# EAGLE schematic RasPiDV (EAGLE 6.3)
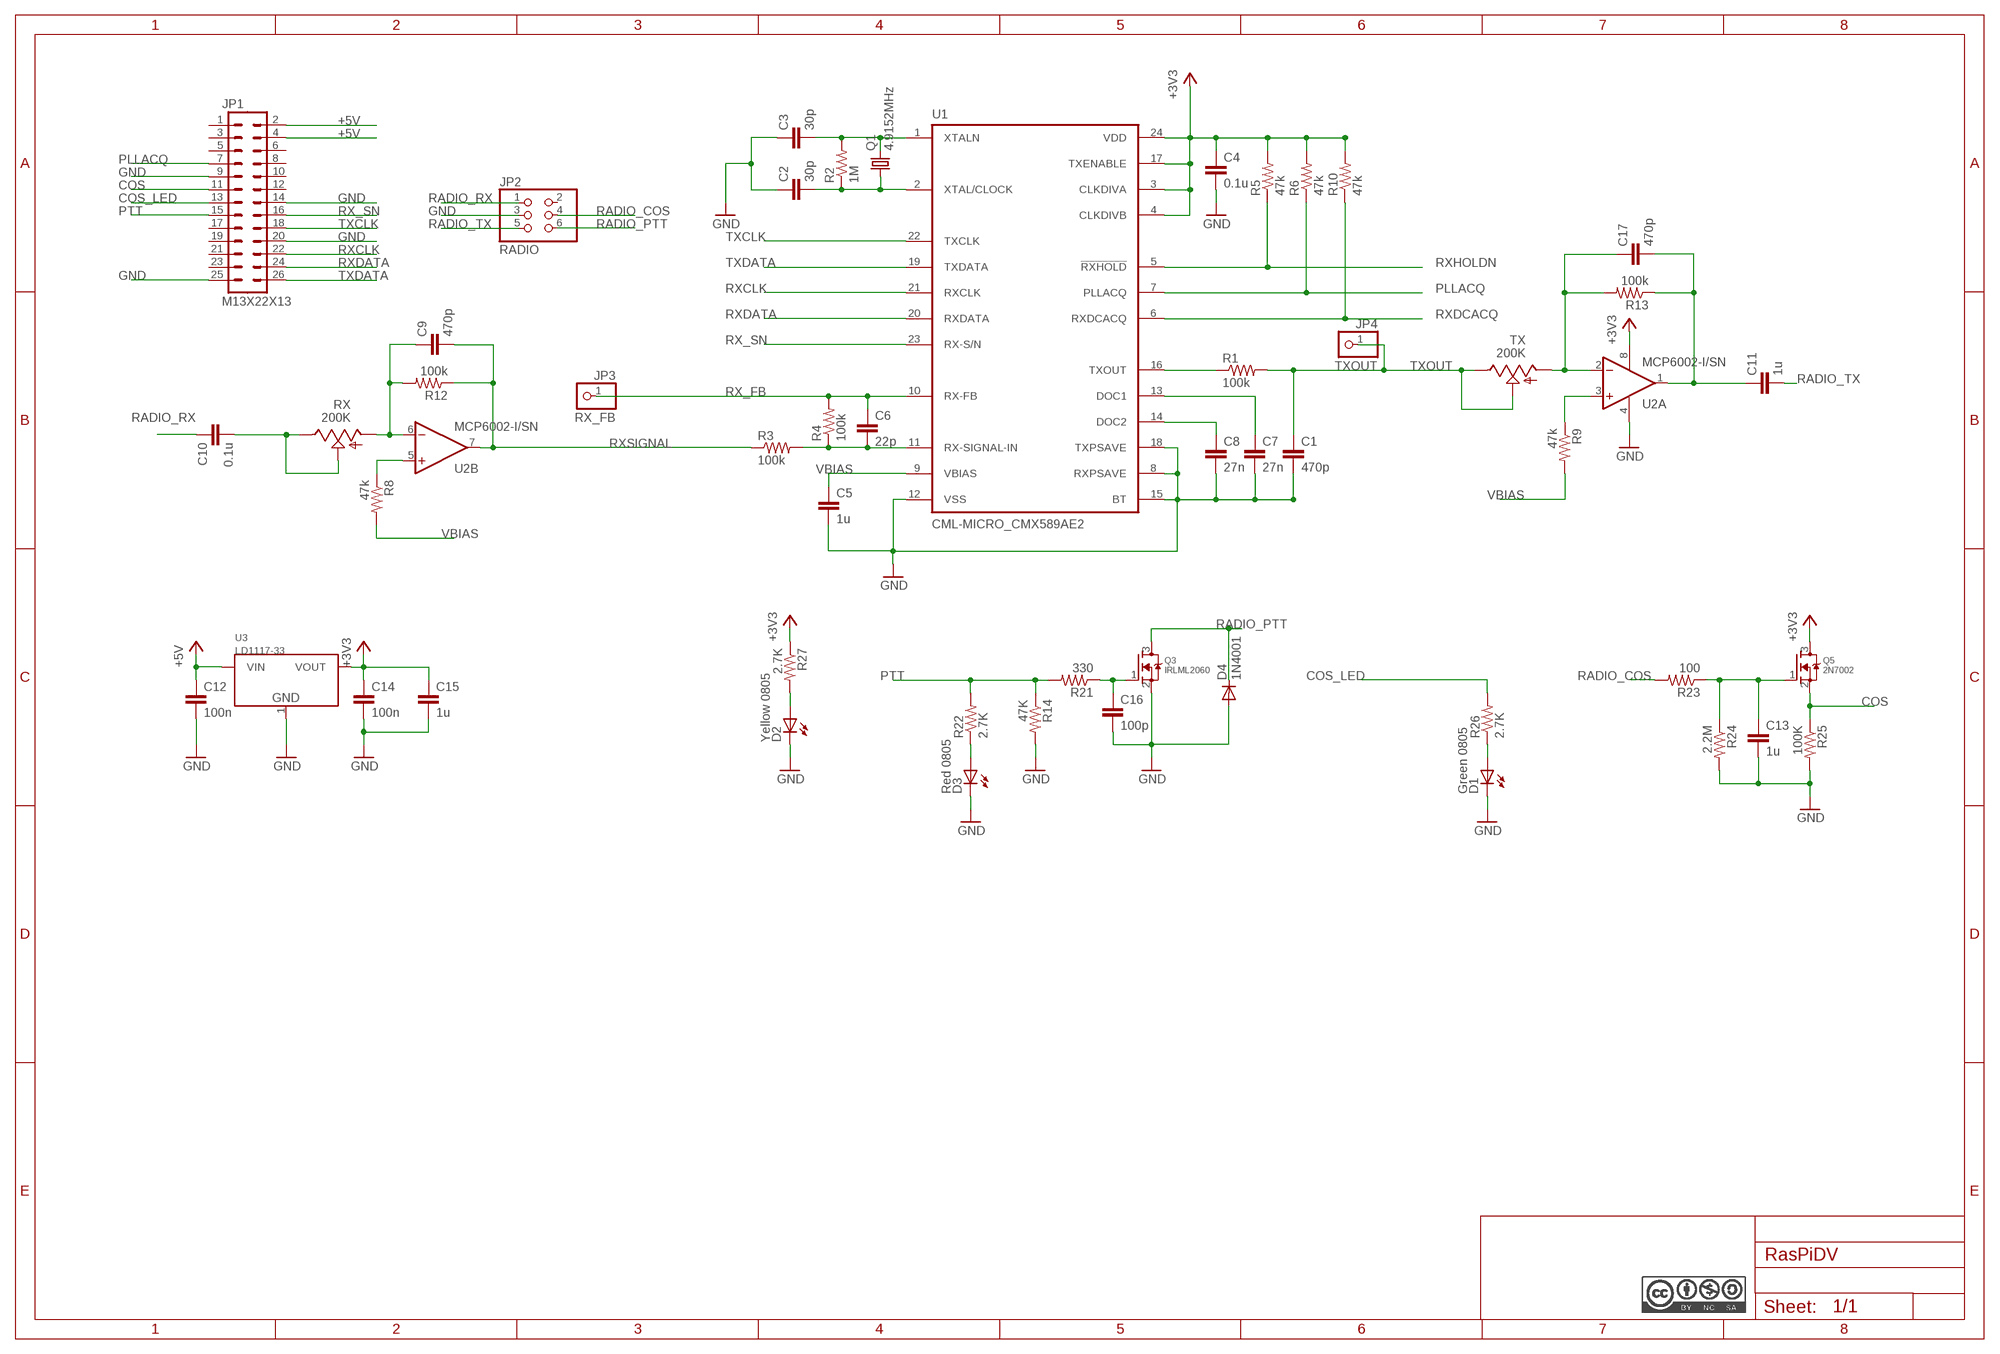
[diagram p0: schematic, sheet 1]

## Parts
C1  470p  C-EUC0805  [C0805]
C2  30p  C-EUC0805  [C0805]
C3  30p  C-EUC0805  [C0805]
C4  0.1u  C-EUC0805  [C0805]
C5  1u  C-EUC0805  [C0805]
C6  22p  C-EUC0805  [C0805]
C7  27n  C-EUC0805  [C0805]
C8  27n  C-EUC0805  [C0805]
C9  470p  C-EUC0805  [C0805]
C10  0.1u  C-EUC0805  [C0805]
C11  1u  C-EUC0805  [C0805]
C12  100n  C-EUC0805  [C0805]
C13  1u  C-EUC0805  [C0805]
C14  100n  C-EUC0805  [C0805]
C15  1u  C-EUC0805  [C0805]
C16  100p  C-EUC0805  [C0805]
C17  470p  C-EUC0805  [C0805]
D1  Green 0805  LEDCHIPLED_0805  [CHIPLED_0805]
D2  Yellow 0805  LEDCHIPLED_0805  [CHIPLED_0805]
D3  Red 0805  LEDCHIPLED_0805  [CHIPLED_0805]
D4  1N4001  DIODE-MICROMELF-R  [MICROMELF-R]
JP1  M13X22X13  [2X13]
JP2  RADIO  HEADER-2X3  [2X03_ROUND_70MIL]
JP3  RX_FB  HEADER-1X1ROUND  [1X01_ROUND]
JP4  TXOUT  HEADER-1X1ROUND  [1X01_ROUND]
Q1  4.9152MHz  CRYSTAL_CRYSTALHC49S  [CRYSTAL_HC49/S]
Q3  IRLML2060  MOSFET-NREFLOW  [SOT23]
Q5  2N7002  MOSFET-NREFLOW  [SOT23-R]
R1  100k  R-US_R0805W  [R0805W]
R2  1M  R-US_R0805W  [R0805W]
R3  100k  R-US_R0805W  [R0805W]
R4  100k  R-US_R0805W  [R0805W]
R5  47k  R-US_R0805W  [R0805W]
R6  47k  R-US_R0805W  [R0805W]
R8  47k  R-US_R0805W  [R0805W]
R9  47k  R-US_R0805W  [R0805W]
R10  47k  R-US_R0805W  [R0805W]
R12  100k  R-US_R0805W  [R0805W]
R13  100k  R-US_R0805W  [R0805W]
R14  47K  R-US_R0805W  [R0805W]
R21  330  R-US_R0805W  [R0805W]
R22  2.7K  R-US_R0805W  [R0805W]
R23  100  R-US_R0805W  [R0805W]
R24  2.2M  R-US_R0805W  [R0805W]
R25  100K  R-US_R0805W  [R0805W]
R26  2.7K  R-US_R0805W  [R0805W]
R27  2.7K  R-US_R0805W  [R0805W]
RX  200K  TRIM_US-B25P  [B25P]
TX  200K  TRIM_US-B25P  [B25P]
U1  CML-MICRO_CMX589AE2  AIS_MK2_CML-MICRO_CMX589AE2  [AIS_MK2_CML-MICRO_TSSOP24]
U2  MCP6002-I/SN  [SOIC-8]
U3  LD1117-33  LD1117-3.3SOT223  [SOT223]

## Nets
+3V3 [pwr]: C4.1 C14.1 C15.1 Q5.3(D) R5.2 R6.2 R10.2 R27.1 U1.3(CLKDIVA) U1.4(CLKDIVB) U1.17(TXENABLE) U1.24(VDD) U2.8(P:V+) U3.2(VOUT)
+5V [pwr]: C12.1 JP1.2 JP1.4 U3.3(VIN)
COS: JP1.11 Q5.2(S) R25.1
COS_LED: JP1.13 R26.2
GND [pwr]: C1.2 C2.1 C3.1 C4.2 C5.2 C7.2 C8.2 C12.2 C13.2 C14.2 C15.2 C16.2 D1.C D2.C D3.C D4.A JP1.9 JP1.14 JP1.20 JP1.25 JP2.3 Q3.2(S) R14.2 R24.2 R25.2 U1.8(RXPSAVE) U1.12(VSS) U1.15(BT) U1.18(TXPSAVE) U2.4(P:V-) U3.1(GND)
N$1: C13.1 Q5.1(G) R23.1 R24.1
N$2: D1.A R26.1
N$3: C10.2 RX.E RX.S
N$4: C8.1 U1.14(DOC2)
N$5: C7.1 U1.13(DOC1)
N$6: C6.2 R3.2 R4.1 U1.11(RX-SIGNAL-IN)
N$7: C9.1 R12.2 RX.A U2.6(B:IN-)
N$9: C2.2 Q1.1 R2.1 U1.2(XTAL/CLOCK)
N$10: C3.2 Q1.2 R2.2 U1.1(XTALN)
N$11: R8.1 U2.5(B:IN+)
N$12: R1.1 U1.16(TXOUT)
N$15: C11.1 C17.2 R13.1 U2.1(A:OUT)
N$16: D2.A R27.2
N$20: R9.1 U2.3(A:IN+)
N$24: C16.1 Q3.1(G) R21.1
N$28: C17.1 R13.2 TX.A U2.2(A:IN-)
N$33: D3.A R22.1
PLLACQ: JP1.7 R6.1 U1.7(PLLACQ)
PTT: JP1.15 R14.1 R21.2 R22.2
RADIO_COS: JP2.4 R23.2
RADIO_PTT: D4.C JP2.6 Q3.3(D)
RADIO_RX: C10.1 JP2.1
RADIO_TX: C11.2 JP2.5
RX_FB: C6.1 JP3.1 R4.2 U1.10(RX-FB)
RX_SN: JP1.16 U1.23(RX-S/N)
RXCLK: JP1.22 U1.21(RXCLK)
RXDATA: JP1.24 U1.20(RXDATA)
RXDCACQ: R10.1 U1.6(RXDCACQ)
RXHOLDN: R5.1 U1.5(!RXHOLD!)
RXSIGNAL: C9.2 R3.1 R12.1 U2.7(B:OUT)
TXCLK: JP1.18 U1.22(TXCLK)
TXDATA: JP1.26 U1.19(TXDATA)
TXOUT: C1.1 JP4.1 R1.2 TX.E TX.S
VBIAS: C5.1 R8.2 R9.2 U1.9(VBIAS)
Unconnected: JP1.1 JP1.3 JP1.5 JP1.6 JP1.8 JP1.10 JP1.12 JP1.17 JP1.19 JP1.21 JP1.23 JP2.2

## Library data of the parts
C1-C17 = resistor:C-EU: CAPACITOR, European symbol
D1-D3 = adafruit:LED: LED OSRAM: - CHIPLED LG R971, LG N971, LY N971, LG Q971, LY Q971, LO R971, LY R971 LH N974, LH R974 LS Q976, LO Q976, LY Q976 LO Q996 - Hyper CHIPLED LW Q18S LB Q993, LB Q99A, LB R99A - SideLED LS A670, LO A670, LY A670, LG A670, LP A670 LB A673, LV A673, LT A673, LW A673 LH A674 LY A675 LS A676, LA A676, LO A676, LY A676, LW A676 LS A679, LY A679, LG A679 - Hyper Micro SIDELED® LS Y876, LA Y876, LO Y876, LY Y876 LT Y87S - SmartLED LW L88C, LW L88S LB L89C, LB L89S, LG L890 LS L89K, LO L89K, LY L89K LS L896, LA L896, LO L896, LY L896 - TOPLED LS T670, LO T670, LY T670, LG T670, LP T670 LSG T670, LSP T670, LSY T670, LOP T670, LYG T670 LG T671, LOG T671, LSG T671 LB T673, LV T673, LT T673, LW T673 LH T674 LS T676, LA T676, LO T676, LY T676, LB T676, LH T676, LSB T676, LW T676 LB T67C, LV T67C, LT T67C, LS T67K, LO T67K, LY T67K, LW E67C LS E67B, LA E67B, LO E67B, LY E67B, LB E67C, LV E67C, LT E67C LW T67C LS T679, LY T679, LG T679 LS T770, LO T770, LY T770, LG T770, LP T770 LB T773, LV T773, LT T773, LW T773 LH T774 LS E675, LA E675, LY E675, LS T675 LS T776, LA T776, LO T776, LY T776, LB T776 LHGB T686 LT T68C, LB T68C - Hyper Mini TOPLED® LB M676 - Mini TOPLED Santana® LG M470 LS M47K, LO M47K, LY M47K Source: http://www.osram.convergy.de/
D4 = diode:DIODE-: DIODE
JP1 = SparkFun-Connectors:M13X2: 0.1" spaced headers
JP2 = microbuilder:HEADER-2X3: PIN HEADER
JP3 JP4 = microbuilder:HEADER-1X1: PIN HEADER
Q1 = AIS_Mk2:CRYSTAL_CRYSTAL: CRYSTAL
Q3 = adafruit:MOSFET-N: N-Channel Mosfet 2N7002E - 60V 260mA SOT23 [Digikey: 2N7002ET1GOSTR-ND] - REEL BSH103 - 30V 850mA SOT23 [Digikey: 568-5013-1-ND]
Q5 = microbuilder:MOSFET-N: N-Channel Mosfet LEGEND VDS: Voltage Drain-Source ID: Drain Current RDS(ON): Drain-Source On-State Resistance VGS(TH): Gate-Source Threshold Voltage CISS: Drain-Source Input Capacitance SOT-23 Name VDS ID RDS(ON) VGS(TH) CISS Order Number 2N7002E 60V 260mA 2.5 Ohm 2.5V @ 250uA 26.7pF @ 25V 2N7002ET1GOSTR-ND BSH103 30V 850mA 400 mOhm 400mV @ 1mA 83pF @ 24V BSH103,235-ND BSS138 60V 320mA 1.6 Ohm 1.5V @ 250uA 50pF @ 10V Mouser: 771-BSS138PW115 DMN2075U-7 20V 4.2A 38 mOhm 1V @ 250 uA 594.3pF @ 10V DMN2075U-7DICT-ND * BSS138 good choice for I2C level-shifting
R1-R6 R8-R10 R12-R14 R21-R27 = resistor:R-US_: RESISTOR, American symbol
RX TX = pot:TRIM_US-: POTENTIOMETER
U1 = 12_dollar:AIS_MK2_CML-MICRO_CMX589A: HIGH-SPEED GMSK MODEM
U2 = linear-mcp-600x:MCP6002: Dual Op Amp 1.8V to 5.5V Single Supply CMOS Source: http://ww1.microchip.com/downloads/en/DeviceDoc/21733h.pdf.
U3 = dp_devices:LD1117-3.3

## Net classes
1 pwr: width 0.381 mm